# EAGLE design RFID v0.3 (EAGLE 9.5.2)
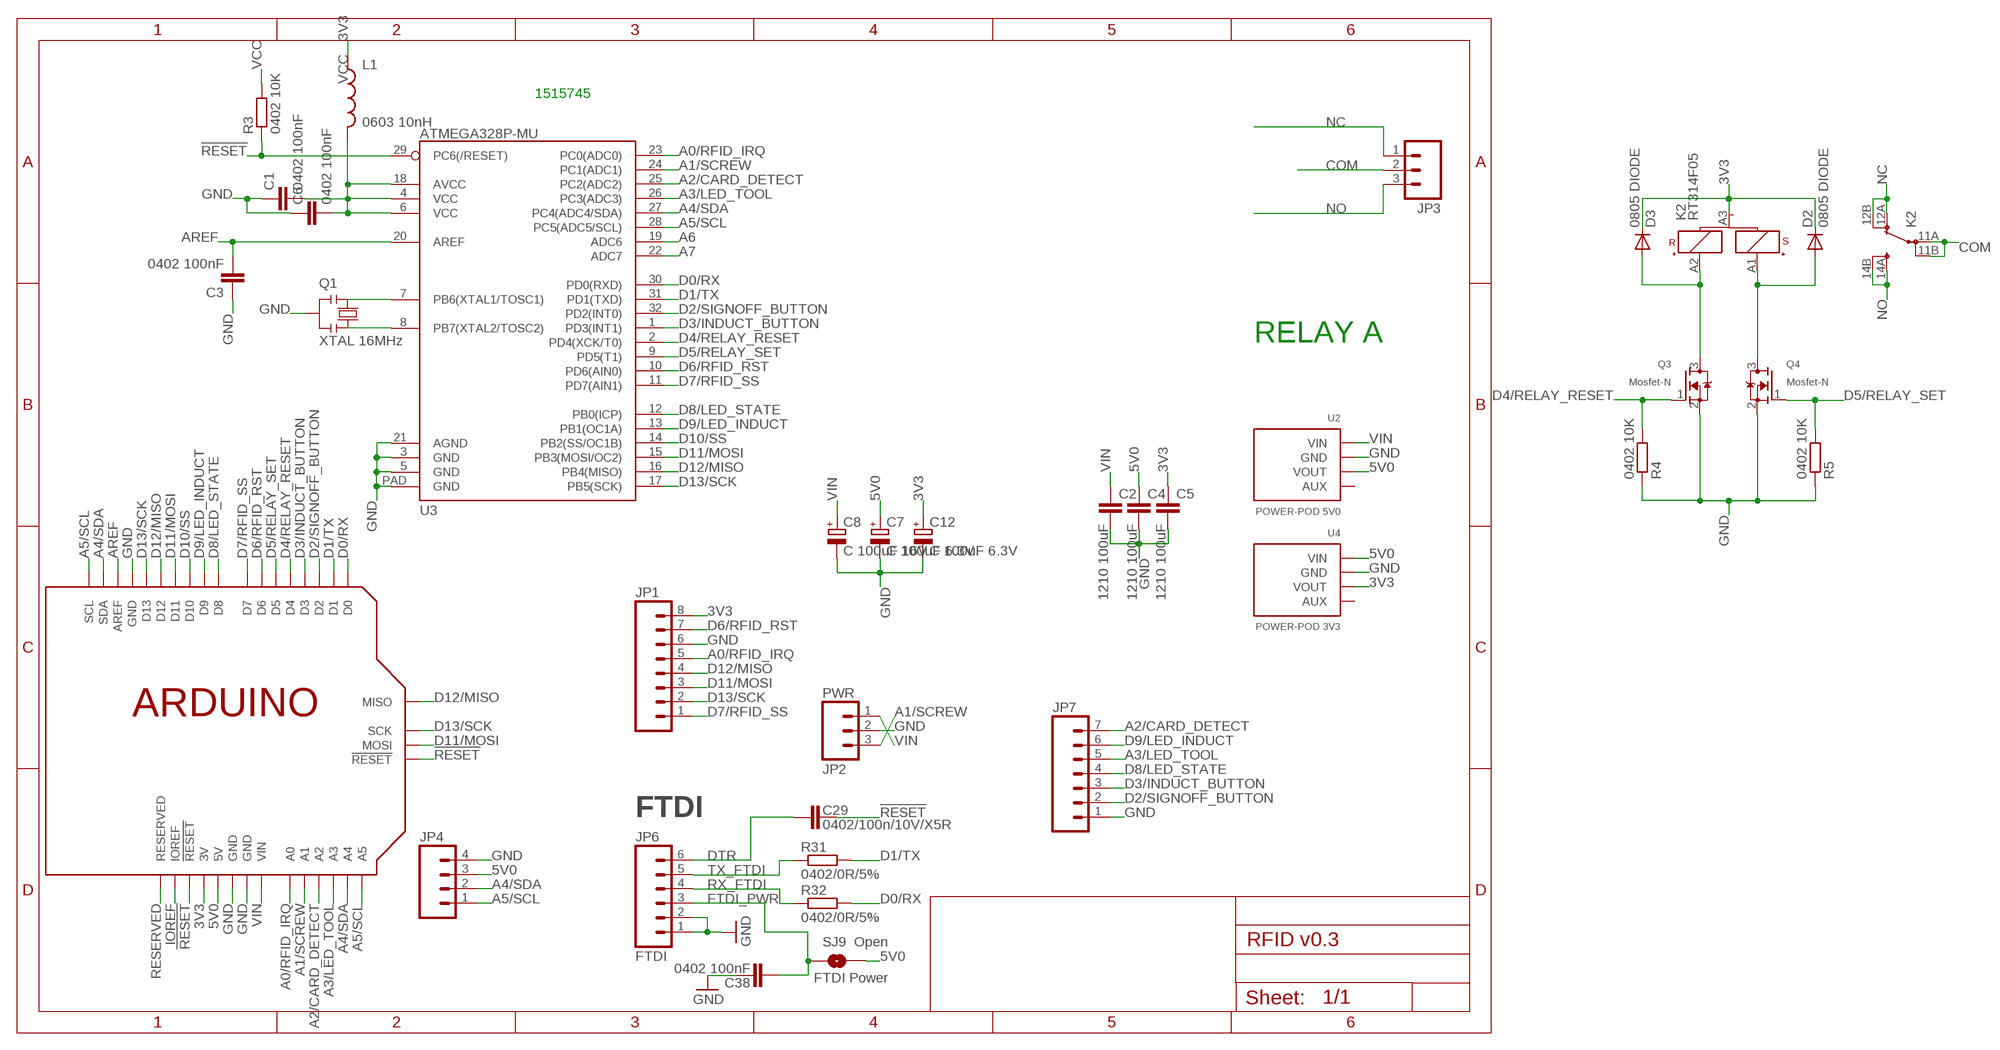
[diagram p0: schematic, sheet 1]

## Parts
C1  0402 100nF  C-EUC0402-SMALLER  [C0402-SMALLER]
C2  1210 100uF  C-EUC1210  [C1210]
C3  0402 100nF  C-EUC0402-SMALLER  [C0402-SMALLER]
C4  1210 100uF  C-EUC1210  [C1210]
C5  1210 100uF  C-EUC1210  [C1210]
C6  0402 100nF  C-EUC0402-SMALLER  [C0402-SMALLER]
C7  C 100uF 6.3V  CPOL-EUC  [PANASONIC_C]
C8  C 100uF 16V  CPOL-EUC  [PANASONIC_C]
C12  C 100uF 6.3V  CPOL-EUC  [PANASONIC_C]
C29  0402/100n/10V/X5R  C-EUC0402-ARDUINO-ROUND  [C0402-ARDUINO-ROUND]
C38  0402 100nF  C-EUC0402-SMALLER  [C0402-SMALLER]
D2  0805 DIODE  DIODE-0805  [0805-DIODE]
D3  0805 DIODE  DIODE-0805  [0805-DIODE]
JP1  M081X08  [1X08]
JP2  PWR  M03-SCREW-5MM  [SCREWTERMINAL-5MM-3]
JP3  M03-SCREW-5MM  [SCREWTERMINAL-5MM-3]
JP4  M04PTH  [1X04]
JP6  FTDI  M06SIP  [1X06]
JP7  M07  [1X07]
K2  RT314F05  [RT1-BI]
L1  0603 10nH  INDUCTOR0603K-SMALL  [C0603K-SMALL]
Q1  XTAL 16MHz  RESONATORMU  [RESONATOR]
Q3  Mosfet-N  MOSFET-N-SOT23-SPARK  [SOT23-3]
Q4  Mosfet-N  MOSFET-N-SOT23-SPARK  [SOT23-3]
R3  0402 10K  R-EU_R0402-SMALLER  [R0402-SMALLER]
R4  0402 10K  R-EU_R0402-SMALLER  [R0402-SMALLER]
R5  0402 10K  R-EU_R0402-SMALLER  [R0402-SMALLER]
R31  0402/0R/5%  R-EU_R0402-ARDUINO-ROUND  [R0402-ARDUINO-ROUND]
R32  0402/0R/5%  R-EU_R0402-ARDUINO-ROUND  [R0402-ARDUINO-ROUND]
SJ9  FTDI Power  SOLDERJUMPERNO  [SJ_2S-NO]
U1  ARDUINOSPI-REFRENCE  [ARDUINOR3-LWKTXT-REF-SPI]
U2  POWER-POD 5V0  POWER-POD  [POWER-POD-LANDING]
U3  ATMEGA328P-MU  ATMEGA328-MLF-SHORT  [MLF32-SHORT-CREAM]
U4  POWER-POD 3V3  POWER-POD  [POWER-POD-LANDING]

## Nets
3V3: C5.1 C12.+ D2.C D3.C JP1.8 K2.A3(1:-) L1.1 U1.3V U4.3(VOUT)
5V0: C4.1 C7.+ JP4.3 SJ9.2 U1.5V U1.5V@ISP(5V) U2.3(VOUT) U4.1(VIN)
!RESET: C29.1 R3.1 U1.!RESET U1.!RESET@ISP(!RESET) U3.29(PC6(/RESET))
A0/RFID_IRQ: JP1.5 U1.A0 U3.23(PC0(ADC0))
A1/SCREW: JP2.3 U1.A1 U3.24(PC1(ADC1))
A2/CARD_DETECT: JP7.7 U1.A2 U3.25(PC2(ADC2))
A3/LED_TOOL: JP7.5 U1.A3 U3.26(PC3(ADC3))
A4/SDA: JP4.2 U1.A4 U1.SDA U3.27(PC4(ADC4/SDA))
A5/SCL: JP4.1 U1.A5 U1.SCL U3.28(PC5(ADC5/SCL))
A6: U3.19(ADC6)
A7: U3.22(ADC7)
AREF: C3.2 U1.AREF U3.20(AREF)
COM [MAINS]: JP3.2 K2.11A(2:PA) K2.11B(2:PB)
D0/RX: R32.2 U1.D0 U3.30(PD0(RXD))
D1/TX: R31.2 U1.D1 U3.31(PD1(TXD))
D2/SIGNOFF_BUTTON: JP7.2 U1.D2 U3.32(PD2(INT0))
D3/INDUCT_BUTTON: JP7.3 U1.D3 U3.1(PD3(INT1))
D4/RELAY_RESET: Q3.1(G) R4.2 U1.D4 U3.2(PD4(XCK/T0))
D5/RELAY_SET: Q4.1(G) R5.2 U1.D5 U3.9(PD5(T1))
D6/RFID_RST: JP1.7 U1.D6 U3.10(PD6(AIN0))
D7/RFID_SS: JP1.1 U1.D7 U3.11(PD7(AIN1))
D8/LED_STATE: JP7.4 U1.D8 U3.12(PB0(ICP))
D9/LED_INDUCT: JP7.6 U1.D9 U3.13(PB1(OC1A))
D10/SS: U1.D10 U3.14(PB2(SS/OC1B))
D11/MOSI: JP1.3 U1.D11 U1.MOSI U3.15(PB3(MOSI/OC2))
D12/MISO: JP1.4 U1.D12 U1.MISO U3.16(PB4(MISO))
D13/SCK: JP1.2 U1.D13 U1.SCK U3.17(PB5(SCK))
DTR: C29.2 JP6.6
FTDI_PWR: C38.2 JP6.3 SJ9.1
GND: C1.1 C2.2 C3.1 C4.2 C5.2 C6.1 C7.- C8.- C12.- C38.1 JP1.6 JP2.2 JP4.4 JP6.1 JP6.2 JP7.1 Q1.2 Q3.2(S) Q4.2(S) R4.1 R5.1 U1.GND@1(GND) U1.GND@2(GND) U1.GND@3(GND) U1.GND@ISP(GND) U2.2(GND) U3.3(GND) U3.5(GND) U3.21(AGND) U3.PAD(GND) U4.2(GND)
IOREF: U1.IOREF
N$1: D2.A K2.A1(1:S+) Q4.3(D)
N$2: D3.A K2.A2(1:R+) Q3.3(D)
N$3: Q1.1 U3.7(PB6(XTAL1/TOSC1))
N$4: Q1.3 U3.8(PB7(XTAL2/TOSC2))
NC [MAINS]: JP3.1 K2.12A(2:OA) K2.12B(2:OB)
NO [MAINS]: JP3.3 K2.14A(2:SA) K2.14B(2:SB)
RESERVED: U1.RESERVED
RX_FTDI: JP6.4 R32.1
TX_FTDI: JP6.5 R31.1
VCC: C1.2 C6.2 L1.2 R3.2 U3.4(VCC) U3.6(VCC) U3.18(AVCC)
VIN: C2.1 C8.+ JP2.1 U1.VIN U2.1(VIN)
Unconnected: U2.4(AUX) U4.4(AUX)

## Notes on the sheet
- 1515745
- RELAY A
- FTDI
- Open

## Library data of the parts
C1-C6 = CISECO eaglecad designs:C-EU: CAPACITOR, European symbol
C7 C8 C12 = rcl:CPOL-EU: POLARIZED CAPACITOR, European symbol
C29 C38 = TiLDA Mk2 Parts:C-EU: CAPACITOR, European symbol
D2 D3 = CISECO eaglecad designs:DIODE-: DIODE
JP1 = SparkFunJan12:M08: Header 8 Standard 8-pin 0.1" header. Use with straight break away headers (SKU : PRT-00116), right angle break away headers (PRT-00553), swiss pins (PRT-00743), machine pins (PRT-00117), and female headers (PRT-00115).
JP2 JP3 = CISECO eaglecad designs:M03: Header 3 Standard 3-pin 0.1" header. Use with straight break away headers (SKU : PRT-00116), right angle break away headers (PRT-00553), swiss pins (PRT-00743), machine pins (PRT-00117), and female headers (PRT-00115). Molex polarized connector foot print use with SKU : PRT-08232 with associated crimp pins and housings.
JP4 = SparkFunJan12:M04: Header 4 Standard 4-pin 0.1" header. Use with straight break away headers (SKU : PRT-00116), right angle break away headers (PRT-00553), swiss pins (PRT-00743), machine pins (PRT-00117), and female headers (PRT-00115). Molex polarized connector foot print use with SKU : PRT-08231 with associated crimp pins and housings. 1MM SMD Version SKU: PRT-10208
JP6 = TiLDA Mk2 Parts:M06: Header 6 Standard 6-pin 0.1" header. Use with straight break away headers (SKU : PRT-00116), right angle break away headers (PRT-00553), swiss pins (PRT-00743), machine pins (PRT-00117), and female headers (PRT-00115). Molex polarized connector foot print use with SKU : PRT-08094 with associated crimp pins and housings. NOTES ON THE VARIANTS LOCK and LOCK_LONGPADS... This footprint was designed to help hold the alignment of a through-hole component (i.e. 6-pin header) while soldering it into place. You may notice that each hole has been shifted either up or down by 0.005 of an inch from it's more standard position (which is a perfectly straight line). This slight alteration caused the pins (the squares in the middle) to touch the edges of the holes. Because they are alternating, it causes a "brace" to hold the component in place. 0.005 has proven to be the perfect amount of "off-center" position when using our standard breakaway headers. Although looks a little odd when you look at the bare footprint, once you have a header in there, the alteration is very hard to notice. Also, if you push a header all the way into place, it is covered up entirely on the bottom side. This idea of altering the position of holes to aid alignment will be further integrated into the Sparkfun Library for other footprints. It can help hold any component with 3 or more connection pins.
JP7 = TiLDA Mk2 Parts:M07: Header 7 Standard 7-pin 0.1" header. Use with straight break away headers (SKU : PRT-00116), right angle break away headers (PRT-00553), swiss pins (PRT-00743), machine pins (PRT-00117), and female headers (PRT-00115). NOTES ON THE VARIANTS LOCK and LOCK_LONGPADS... This footprint was designed to help hold the alignment of a through-hole component (i.e. 7-pin header) while soldering it into place. You may notice that each hole has been shifted either up or down by 0.005 of an inch from it's more standard position (which is usually a perfectly straight line). This slight alteration caused the pins (the squares in the middle) to touch the edges of the holes. Because they are alternating, it causes a "brace" to hold the header in place. 0.005 has proven to be the perfect amount of "off-center" position when using our standard breakaway headers. Although looks a little odd when you look at the bare footprint, once you have a header in there, the alteration is very hard to notice. Also, if you push a header all the way into place, it is covered up entirely on the bottom side. This idea of altering the position of holes to aid alignment will be further integrated into the Sparkfun Library for other footprints. It can help hold any component with 3 or more connection pins.
K2 = relay:RT?F*: Power PCB Relay SCHRACK bistable 1 pole 16 A, polarized bistable version Source: http://www.schrack.com/.. 5821.pdf; MPN: RT314F05; OC_FARNELL: unknown; OC_NEWARK: 48M7949
L1 = CISECO eaglecad designs:INDUCTOR: Inductors Basic Inductor/Choke - 0603 and 1206. Footprints are not proven and vary greatly between part numbers.
Q1 = MySMD2:RESONATOR
Q3 Q4 = TiLDA Mk2 Parts:MOSFET-N: N-Channel Mosfet 2N7002E - 60V 260mA SOT23 [Digikey: 2N7002ET1GOSTR-ND] - REEL BSH103 - 30V 850mA SOT23 [Digikey: 568-5013-1-ND]
R3-R5 = CISECO eaglecad designs:R-EU_: RESISTOR, European symbol
R31 R32 = TiLDA Mk2 Parts:R-EU_: RESISTOR, European symbol
SJ9 = TiLDA Mk2 Parts:SOLDERJUMPER: Solder Jumper Standard SMD solder jumper. Used to automate production. Two varients : Normally Open and Normally Closed are the same, but have different paste layers. NC will have a large amount of paste and should jumper during reflow.
U1 = CISECO eaglecad designs:ARDUINOSPI
U2 U4 = Ciseco Footprints:POWER-POD
U3 = CISECO eaglecad designs:ATMEGA328-MLF

## Net classes
0 default: width 0.15 mm, drill 0.3 mm, clearance 0.15 mm
2 MAINS: clearance 4 mm

## Board
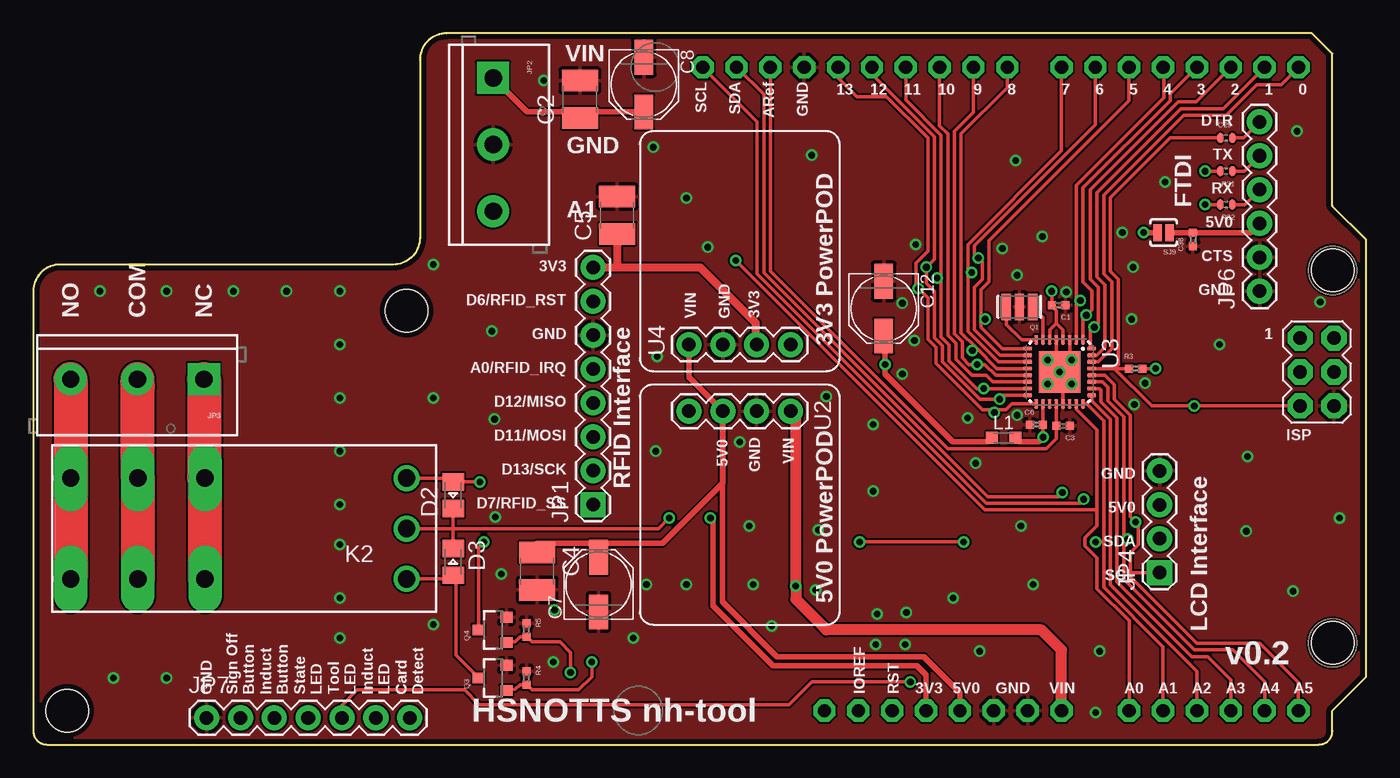
[diagram p1: board, top side]
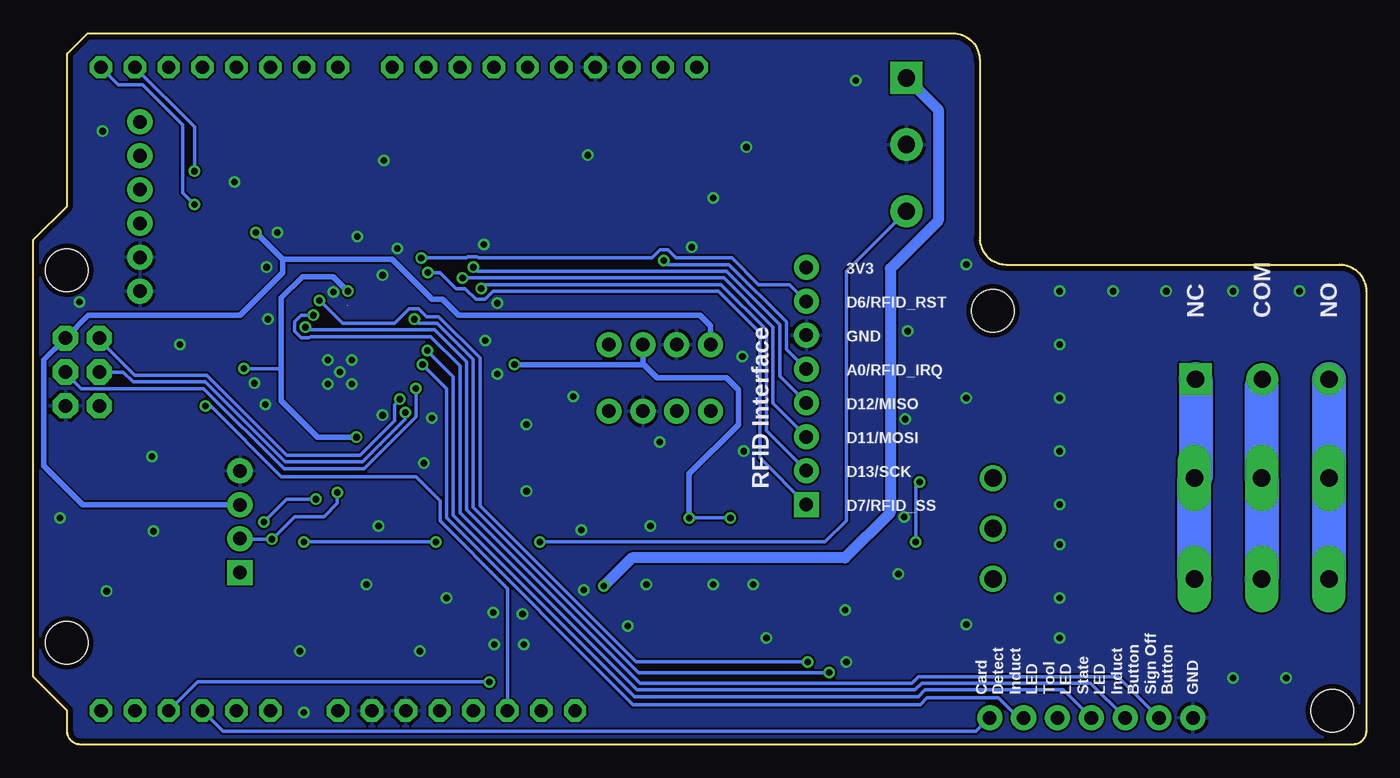
[diagram p2: board, bottom side, seen from below]

Size 100 x 53.34 mm. Coordinates in mm from the lower left corner, seen from the top.
Outline: 95.94,53.34 31,53.34 arc90 29,51.34 29,38 arc-90 27,36 2,36 arc90 0,34 0,1 arc90 1,0 96.46,0 arc90 97.46,1 97.46,2.54 100,5.08 100,37.85 97.46,40.39 97.46,51.82 95.94,53.34
Copper layers (1*16): Top 0.0356mm / dielectric 1.5011mm / Bottom 0.0356mm
Design rules "default *": minimum track width 6mil, minimum drill 13mil, track to track 6mil, track to pad 6mil, pad to pad 6mil, via to via 6mil, smd to smd 6mil, copper to edge 15mil, drill to drill 6mil, minimum pad ring 7mil, minimum via ring 7mil, stop-mask expansion 3mil, vias tented up to drill 23mil, thermal gap 10mil
Holes 3.2 mm at 2.54,2.54 97.48,35.56 97.48,7.62 28,32.54

### Footprints (pad centres in the part's own frame; a part is rotated, then mirrored left to right if it is on the bottom)
C0402-SMALLER = smd 0.6 x 0.6: 1 -0.5,0; 2 0.5,0
C1210 = smd 1.6 x 2.7: 1 -1.4,0; 2 1.4,0
PANASONIC_C = smd 2.6 x 1.4: + 2.05,0; - -2.05,0
C0402-ARDUINO-ROUND = smd 0.508 x 0.762: 1 -0.445,0; 2 0.445,0
0805-DIODE = smd 1.3 x 1.6: A 1,0; C -1,0
1X08 = drill 1.016 pad 1.88 square: 1 0,0 | drill 1.016 pad 1.88: 2 2.54,0; 3 5.08,0; 4 7.62,0; 5 10.16,0; 6 12.7,0; 7 15.24,0; 8 17.78,0
SCREWTERMINAL-5MM-3 = drill 1.3 pad 2.413 square: 1 0,0 | drill 1.3 pad 2.413: 2 5,0; 3 10,0
1X04 = drill 1.016 pad 1.88 square: 1 0,0 | drill 1.016 pad 1.88: 2 2.54,0; 3 5.08,0; 4 7.62,0
1X06 = drill 1.016 pad 1.88: 1 0,0; 2 2.54,0; 3 5.08,0; 4 7.62,0; 5 10.16,0; 6 12.7,0
1X07 = drill 1.016 pad 1.88: 1 0,0; 2 2.54,0; 3 5.08,0; 4 7.62,0; 5 10.16,0; 6 12.7,0; 7 15.24,0
RT1-BI = drill 1.3 pad 2.5 long: 11A 7.56,3.78; 11B 7.56,-3.78; 12A 2.52,3.78; 12B 2.52,-3.78; 14A 12.6,3.78; 14B 12.6,-3.78 | drill 1.3: A1 -12.6,-3.78; A2 -12.6,3.78; A3 -12.6,0
C0603K-SMALL = smd 0.889 x 0.889: 1 -0.875,0; 2 0.875,0
RESONATOR = smd 0.7 x 2: 1 -1,0; 2 0,0; 3 1,0
SOT23-3 = smd 0.8 x 0.9: 1 -0.95,-1; 2 0.95,-1; 3 0,1.1
R0402-SMALLER = smd 0.6 x 0.6: 1 -0.5,0; 2 0.5,0
R0402-ARDUINO-ROUND = smd 0.508 x 0.762: 1 -0.445,0; 2 0.445,0
SJ_2S-NO = smd 0.635 x 1.27: 1 -0.45,0; 2 0.45,0
ARDUINOR3-LWKTXT-REF-SPI = drill 1 pad 1.676 octagon: 3V 35.56,2.54; 5V 38.1,2.54; !RESET 33.02,2.54; A0 50.8,2.54; A1 53.34,2.54; A2 55.88,2.54; A3 58.42,2.54; A4 60.96,2.54; A5 63.5,2.54; AREF 23.876,50.8; D0 63.5,50.8; D1 60.96,50.8; D2 58.42,50.8; D3 55.88,50.8; D4 53.34,50.8; D5 50.8,50.8; D6 48.26,50.8; D7 45.72,50.8; D8 41.656,50.8; D9 39.116,50.8; D10 36.576,50.8; D11 34.036,50.8; D12 31.496,50.8; D13 28.956,50.8; GND@1 43.18,2.54; GND@2 40.64,2.54; GND@3 26.416,50.8; IOREF 30.48,2.54; RESERVED 27.94,2.54; SCL 18.796,50.8; SDA 21.336,50.8; VIN 45.72,2.54 | drill 1.016 pad 1.88 octagon: 5V@ISP 66.167,30.48; !RESET@ISP 63.627,25.4; GND@ISP 66.167,25.4; MISO 63.627,30.48; MOSI 66.167,27.94; SCK 63.627,27.94
POWER-POD-LANDING = drill 1.016 pad 1.88: 1 -3.81,0; 2 -1.27,0; 3 1.27,0; 4 3.81,0
MLF32-SHORT-CREAM = smd 0.7 x 0.28: 1 -2.4,1.75; 2 -2.4,1.25; 3 -2.4,0.75; 4 -2.4,0.25; 5 -2.4,-0.25; 6 -2.4,-0.75; 7 -2.4,-1.25; 8 -2.4,-1.75; 17 2.4,-1.75; 18 2.4,-1.25; 19 2.4,-0.75; 20 2.4,-0.25; 21 2.4,0.25; 22 2.4,0.75; 23 2.4,1.25; 24 2.4,1.75 | smd 0.28 x 0.7: 9 -1.75,-2.4; 10 -1.25,-2.4; 11 -0.75,-2.4; 12 -0.25,-2.4; 13 0.25,-2.4; 14 0.75,-2.4; 15 1.25,-2.4; 16 1.75,-2.4; 25 1.75,2.4; 26 1.25,2.4; 27 0.75,2.4; 28 0.25,2.4; 29 -0.25,2.4; 30 -0.75,2.4; 31 -1.25,2.4; 32 -1.75,2.4 | smd 3.1 x 3.1: PAD 0,0

### Placement (x,y rotation side)
C1  76.93,32.94 180 top
C2  41,48.4 90 top
C3  77.25,23.9 180 top
C4  37.8,13 270 top
C5  43.8,39.7 90 top
C6  75.25,24 0 top
C7  42.4,12 90 top
C8  45.8,49.5 270 top
C12  63.8,32.7 270 top
C29  89.5,45.5 0 top
C38  87,37.88 90 top
D2  31.5,18.7 90 top
D3  31.5,13.7 270 top
JP1  42,18 90 top
JP2  34.5,50 270 top
JP3  12.8,27.4 180 top
JP4  84.5,12.9 90 top
JP6  92,34 90 top
JP7  13,2 0 top
K2  15.4,16.2 180 top
L1  72.8,23 0 top
Q1  73.98,32.83 180 top
Q3  34.5,5 90 top
Q4  34.5,8.6 90 top
R3  82.7,28.2 0 top
R4  37,5 270 top
R5  37,8.6 270 top
R31  89.5,43 180 top
R32  89.5,40.5 180 top
SJ9  84.8,38.4 180 top
U1  31.42,0 0 top
U2  53,25 180 top
U3  77,27.95 270 top
U4  53,30 0 top

### Tracks (layer width: path | path; a pad name or v marks a point on that pad's centre or on a via)
3V3  (via drill 0.5)
  Top 0.254: K2.A3 31.52,16.2 | D2.C 31.5,16.22 31.52,16.2 | D3.C 31.5,16.18 31.52,16.2 | 31.52,16.2 46.9,16.2 v47.7,17
  Top 0.406: U1.3V 66.98,5.22 66.3,5.9 55.5,5.9 51,10.4 51,16.8 v50.8,17 | C12.+ 63.9,30.65 v63.9,28.5 63.9,27.8 69,22.7 71.62,22.7 L1.1
  Top 0.61: U4.3 54.2,30.07 54.2,31.6 50.02,35.78 JP1.8 43.8,35.78 C5.1
  Bottom 0.254: v47.7,17 v50.8,17
  Bottom 0.406: v50.8,17 50.8,20.3 47.1,24 47.1,26.6 48,27.5 53.2,27.5 54.3,28.6 | U4.3 54.27,28.63 54.3,28.6 | 54.3,28.6 54.4,28.5 v63.9,28.5
5V0  (via drill 0.5)
  Top 0.406: U1.5V 69.52,3.88 66.8,6.6 55.8,6.6 51.7,10.7 51.7,25 U2.3 | U4.1 49.19,27.54 U2.3 | 42.4,15.1 37.8,15.1 C4.1 | 42.4,15.1 47.2,15.1 51.73,19.63 U2.3 | v83.3,38.4 SJ9.2 | C7.+ 42.4,15.1
  Bottom 0.406: 81.3,36.4 73.1,36.4 70.1,33.4 69.3,33.4 68.1,32.2 50,32.2 49.2,31.4 U4.1 | 81.3,36.4 81.3,35.4 84.5,32.2 95.87,32.2 U1.5V@ISP 99.2,28.87 99.2,20.9 96.28,17.98 JP4.3 | 81.3,36.4 v83.3,38.4
!RESET  (via drill 0.5)
  Top 0.254: C29.1 85.3,45.5 80.8,41 80.8,35.5 81.4,34.9 81.4,28.5 81.1,28.2 | 81.1,28.2 R3.1 | 81.1,28.2 U3.29 | U1.!RESET@ISP v87.1,25.4 83.9,25.4 81.1,28.2
  Bottom 0.254: U1.!RESET 64.4,2.58 64.4,11.7 69.5,16.8 69.5,18.3 71.3,20.1 81.4,20.1 86.7,25.4 v87.1,25.4
A0/RFID_IRQ  (via drill 0.5)
  Top 0.254: 79.8,17.6 79.8,23.6 78.25,25.15 U3.23 | 79.8,17.6 79.8,16.4 78.9,15.5 78.9,14.9 79.8,14 79.8,11.7 82.22,9.28 U1.A0 | v52.7,36.3 71.4,17.6 79.8,17.6
  Bottom 0.254: JP1.5 43.5,29.66 43.5,31.7 47.8,36 52.4,36 v52.7,36.3
A1/SCREW  (via drill 0.5)
  Top 0.254: 80.3,15.2 80.3,24.3 79.05,25.55 U3.24 | 80.3,15.2 80.3,11.8 84.76,7.34 U1.A1 | v62,15.2 v69.8,15.2 | v79.7,15.2 80.3,15.2
  Bottom 0.254: v62,15.2 40.6,15.2 39,16.8 39,35.5 JP2.3 | v69.8,15.2 v79.7,15.2
A2/CARD_DETECT
  Top 0.254: U1.A2 87.3,5.5 80.8,12 80.8,24.4 79.4,25.8 U3.25
  Bottom 0.254: JP7.7 28.3,2 29.3,1 85.76,1 U1.A2
A3/LED_TOOL  (via drill 0.5)
  Top 0.254: U1.A3 89.84,4.86 88.1,6.6 86.9,6.6 81.3,12.2 81.3,24.5 80.1,25.7 80.1,26.6 80,26.7 U3.26 | JP7.5 23.16,2.96 24.3,4.1 32.35,4.1 33.45,3 56.7,3 58.4,4.7 v65.8,4.7
  Bottom 0.254: v65.8,4.7 87.68,4.7 U1.A3
A4/SDA  (via drill 0.5)
  Top 0.254: 81.8,15.4 81.8,24.6 80.6,25.8 80.6,26.8 80.2,27.2 U3.27 | 81.8,15.4 81.8,12.4 87.1,7.1 90,7.1 92.38,4.72 U1.A4 | v82.1,15.4 81.8,15.4 | U1.SDA 54.8,48.76 54.8,35.4 71.6,18.6 76.9,18.6 v77.2,18.9
  Bottom 0.254: JP4.2 84.5,15.4 v82.1,15.4 80.4,17.1 78.2,17.1 77.2,18.1 v77.2,18.9
A5/SCL  (via drill 0.5)
  Top 0.254: 82.3,12.9 82.3,12.6 87.3,7.6 92,7.6 94.92,4.68 U1.A5 | JP4.1 82.3,12.9 | 82.3,12.9 82.3,14.4 82.9,15 82.9,16.5 v82.7,16.7 82.3,17.1 82.3,24.7 81.1,25.9 81.1,27 80.4,27.7 U3.28 | U1.SCL 54.3,46.72 54.3,35.3 71.5,18.1 78.5,18.1 v78.8,18.4
  Bottom 0.254: v78.8,18.4 81,18.4 v82.7,16.7
AREF
  Top 0.254: U1.AREF 55.3,35.5 68.6,22.2 76,22.2 76.75,22.95 C3.2 U3.20
COM
  Top 2.54: JP3.2 7.84,26.86 K2.11B K2.11A
  Bottom 2.54: K2.11A K2.11B 7.84,26.86
D0/RX  (via drill 0.5)
  Top 0.254: U1.D0 93.62,49.5 91.8,49.5 89.5,47.2 86.3,47.2 80.3,41.2 80.3,35.3 80.9,34.7 80.9,29.7 79.9,28.7 U3.30 | R32.2 v87.9,40.5
  Bottom 0.254: v87.9,40.5 88.8,41.4 88.8,46.5 91.8,49.5 93.62,49.5 U1.D0
D1/TX  (via drill 0.5)
  Top 0.254: U1.D1 89.28,47.7 86.1,47.7 79.8,41.4 79.8,35.1 80.4,34.5 80.4,29.8 79.8,29.2 U3.31 | R31.2 v87.9,43
  Bottom 0.254: v87.9,43 87.9,46.32 U1.D1
D2/SIGNOFF_BUTTON  (via drill 0.5)
  Top 0.254: U1.D2 87.24,48.2 85.9,48.2 79.3,41.6 79.3,34.9 79.9,34.3 79.9,31.6 v79.6,31.3 79.3,31.3 79.3,29.8 U3.32
  Bottom 0.254: JP7.2 18.64,5.1 33.6,5.1 34.1,4.6 54.5,4.6 67.5,17.6 67.5,28.7 69.9,31.1 79.4,31.1 v79.6,31.3
D3/INDUCT_BUTTON  (via drill 0.5)
  Top 0.254: U3.1 78.75,32.2 v79,32.2 79.4,32.6 79.4,34.05 78.75,34.7 78.75,41.75 85.3,48.3 85.3,48.8 U1.D3
  Bottom 0.254: JP7.3 20.68,4.6 33.35,4.6 33.85,4.1 54.7,4.1 68,17.4 68,28.4 70.2,30.6 79.2,30.6 79.3,30.5 79.9,30.5 80.4,31 80.4,31.7 79.9,32.2 v79,32.2
D4/RELAY_RESET  (via drill 0.5)
  Top 0.254: U1.D4 84.8,50.76 84.8,48.5 78.25,41.95 78.25,33.3 | U3.2 78.25,33.3 | 78.25,33.3 v78.55,33.3 | v41.9,6.2 41.9,5.1 40.9,4.1 37.4,4.1 R4.2 36.5,4.5 36.15,4.15 35.58,4.12 Q3.1
  Bottom 0.254: v78.55,33.3 78.2,33 76.8,31.6 72.9,31.6 71.8,32.7 71.1,32.7 70.5,32.1 69.6,32.1 66.5,29 66.5,17.9 54.8,6.2 v41.9,6.2
D5/RELAY_SET  (via drill 0.5)
  Top 0.254: 71.1,31.9 71.1,31.3 72.7,29.7 U3.9 | 71.1,31.9 71.1,34.1 71.7,34.7 71.7,37.8 82.2,48.3 82.2,50.78 U1.D5 | v71.4,31.9 71.1,31.9 | v40.3,5.4 40.3,6.9 39.5,7.7 37.4,7.7 R5.2 36.52,8.1 36.15,7.72 35.58,7.72 Q4.1
  Bottom 0.254: v40.3,5.4 54.6,5.4 67,17.8 67,28.9 69.7,31.6 71.1,31.6 v71.4,31.9
D6/RFID_RST  (via drill 0.5)
  Top 0.254: U1.D6 79.68,46.48 70.6,37.4 70.6,36.8 v70.9,36.5 71.2,36.2 71.2,34.9 70.6,34.3 70.6,31.1 72.5,29.2 U3.10
  Bottom 0.254: JP1.7 43.26,34.5 45.6,34.5 47.6,36.5 51.8,36.5 52.4,37.1 53,37.1 53.6,36.5 66.6,36.5 66.7,36.6 67.4,36.6 67.5,36.5 v70.9,36.5
D7/RFID_SS  (via drill 0.5)
  Top 0.254: U3.11 72.4,28.7 70.1,31 70.1,35.4 | 70.1,35.4 70.1,37.5 77.14,44.54 U1.D7 | v70.4,35.4 70.1,35.4
  Bottom 0.254: JP1.1 45.5,21.5 45.5,30.9 48.6,34 65.5,34 66.1,33.4 66.8,33.4 67.6,34.2 68.3,34.2 69.5,35.4 v70.4,35.4
D8/LED_STATE  (via drill 0.5)
  Top 0.254: U3.12 72.3,28.2 70.7,29.8 | 70.7,29.8 69.6,30.9 69.6,45.8 73.08,49.28 U1.D8 | v70.45,29.55 70.7,29.8
  Bottom 0.254: JP7.4 22.72,4.1 33.1,4.1 33.6,3.6 54.9,3.6 68.5,17.2 68.5,27.6 v70.45,29.55
D9/LED_INDUCT  (via drill 0.5)
  Top 0.254: U3.13 72.2,27.7 71.4,28.5 v70.8,28.5 70.2,28.5 69.7,29 69.7,30.2 69.1,30.8 69.1,46 70.54,47.44 U1.D9
  Bottom 0.254: JP7.6 26.1,2 27.6,3.5 32.95,3.5 33.45,3 55,3 69,17 69,26.7 v70.8,28.5
D10/SS
  Top 0.254: U3.14 72,27.2 71.5,27.7 70.4,27.7 69.2,28.9 69.2,30.1 68.6,30.7 68.6,45.8 68,46.4 U1.D10
D11/MOSI  (via drill 0.5)
  Top 0.254: U3.15 v71.3,26.7 70.8,26.7 68.7,28.8 68.7,30 68.1,30.6 68.1,35 | 68.1,35 68.1,45.7 65.46,48.34 U1.D11 | v67.8,35 68.1,35
  Bottom 0.254: JP1.3 44.5,25.58 44.5,31.3 48.2,35 v67.8,35 | U1.MOSI 97.59,27.89 96.4,26.7 87.2,26.7 81.2,20.7 75.2,20.7 71.3,24.6 v71.3,26.7
D12/MISO  (via drill 0.5)
  Top 0.254: U3.16 72.8,26.2 v72.5,25.9 71,25.9 68.2,28.7 68.2,29.9 67.6,30.5 67.6,34 67,34.6 v67,35.8 67.6,36.4 67.6,45.6 62.92,50.28 U1.D12
  Bottom 0.254: JP1.4 44,27.62 44,31.5 48,35.5 66.7,35.5 v67,35.8 | U1.MISO 95.05,30.35 92.4,27.7 87,27.7 81,21.7 75.5,21.7 72.9,24.3 72.9,25.5 v72.5,25.9
D13/SCK  (via drill 0.5)
  Top 0.254: U1.D13 60.38,50.02 61.8,48.6 64,48.6 67.1,45.5 67.1,37 66.2,36.1 66.2,34.4 v66.4,34.2 67.1,33.5 67.1,30.4 67.7,29.8 67.7,28.6 71.2,25.1 72.1,25.1 | U3.17 73.4,25.55 72.95,25.1 72.1,25.1 | v72.1,24.9 72.1,25.1
  Bottom 0.254: JP1.2 45,23.54 45,31.1 48.4,34.5 66.1,34.5 v66.4,34.2 | U1.SCK 93.24,27.94 92.5,27.2 87.1,27.2 81.1,21.2 75.3,21.2 72.1,24.4 v72.1,24.9
DTR
  Top 0.254: JP6.6 90.8,45.5 C29.2
FTDI_PWR
  Top 0.406: JP6.3 91.31,38.39 C38.2 86.99,38.4 SJ9.1
GND  (via drill 0.5)
  Top 0.254: U3.5 76.75,28.2 U3.PAD | U3.PAD 77.75,28.7 U3.3 | U3.21 77.25,27.95 U3.PAD
  other vias: 77,27.95 76.1,27.05 77.9,27.05 77.9,28.85 76.1,28.85 77.5,33.95 73.8,24.7 82.6,25.5 83.4,27.1 73.8,35.2 82.4,31.9 82.5,35.8 65.2,27.8 65.2,33.1 66.2,37.5 50.6,37.3 46.8,29.1 53,22.7 46.7,22 53.7,16.4 58.9,16.1 55.4,8.9 63.3,9.8 58.7,11.6 65.5,9.9 63.2,7.5 65.4,7.5 79.7,2.4 74.1,16.4 70.7,21.1 70.1,24.5 59.5,26.1 58.4,44.2 73.7,43.8 75.7,38.1 84.9,42.2 94.8,46 96.55,33.2 91.1,21.6 94.5,11.5 39.1,10.1 39,6.2 35.1,12.8 34.65,17.06 38.3,49.8 46.5,44.8 34.6,24.4 34.4,31 72.7,37.2 81.7,38.4 66.1,30.3 5,34 10,34 15,34 19,34 23,34 23,30 23,26 23,22 23,18 23,15 23,11 6,5 10,5 23,8 30,36 30,26 49,41 89,30 98,17 91,16 80,7 75,12 69,11 71,7 63,19 63,24 54,12 49,12 46,12 45,8 30,9
  pour Bottom: 0,1 arc90 1,0 96.46,0 arc90 97.46,1 97.46,2.54 100,5.1 100,37.85 97.46,40.39 97.46,51.82 95.94,53.34 31,53.34 arc90 29,51.34 29,38 arc-90 27,36 2,36 arc90 0,34
  pour Top: 95.94,53.34 31,53.34 arc90 29,51.34 29,38 arc-90 27,36 2,36 arc90 0,34 0,1 arc90 1,0 96.46,0 arc90 97.46,1 97.46,2.54 100,5.1 100,37.85 97.46,40.39 97.46,51.82
N$1  (via drill 0.5)
  Top 0.254: K2.A1 31.72,19.98 D2.A v33.5,19.7 | Q4.3 33.4,14.8 v33.8,15.2
  Bottom 0.254: v33.8,15.2 33.8,19.4 v33.5,19.7
N$2
  Top 0.254: K2.A2 31.22,12.42 | 31.22,12.42 D3.A | 31.22,12.42 31.6,12.4 31.72,12.4 31.72,6.68 Q3.3
N$3
  Top 0.254: Q1.1 75.75,32.06 U3.7
N$4
  Top 0.254: Q1.3 73,32.81 73,31.5 74.15,30.35 U3.8
NC
  Top 2.54: K2.12A K2.12B 12.8,20.06 JP3.1
  Bottom 2.54: JP3.1 12.8,20.06 | K2.12A K2.12B
NO
  Top 2.54: JP3.3 K2.14B K2.14A
  Bottom 2.54: JP3.3 K2.14B K2.14A
RX_FTDI
  Top 0.254: JP6.4 90.88,40.5 R32.1
TX_FTDI
  Top 0.254: JP6.5 90.84,43 R31.1
VCC  (via drill 0.5)  (1 unrouted)
  Top 0.254: U3.18 C6.2 v75.75,23.05 | C1.2 76.47,32.9 76.5,32.9 | 76.75,31.6 77.25,31.1 U3.4 | 76.75,31.6 76.25,31.1 U3.6 | 76.75,31.6 76.75,32.52 76.4,32.87 | 76.4,32.87 76.43,32.9 | 76.4,32.87 v76.4,34 | R3.2 v84.2,28.2
  Top 0.406: v75.75,23.05 75.4,22.7 73.97,22.7 L1.2
  Bottom 0.254: v84.2,28.2 81.4,28.2
  Bottom 0.406: v76.4,34 77.5,35.1 79.8,35.1 81.4,33.5 81.4,28.2 81.4,25.8 78.65,23.05 v75.75,23.05
VIN  (via drill 0.5)
  Top 0.254: C2.1 41,47.35 41.1,47.45
  Top 0.406: C8.+ 41.1,47.45 37.04,47.45 37.03,47.47 JP2.1
  Top 0.813: U1.VIN 77.14,7.1 75.64,8.6 59.5,8.6 57.2,10.9 v57.2,11.9 57.2,24.61 U2.1
  Bottom 0.813: JP2.1 32.1,47.61 32.1,39.3 35.7,35.7 35.7,17.4 39.1,14 55.1,14 v57.2,11.9

### Text on the board
tPlace: VIN | DTR | TX | GND | RX | A1 | FTDI | 5V0 | CTS | 3V3 | D6/RFID_RST | GND | NO | COM | NC | 3V3 | GND | 1 | 3V3 PowerPOD | A0/RFID_IRQ | D12/MISO | D11/MOSI | 5V0 | ISP | D13/SCK | GND | RFID Interface | D7/RFID_SS | 5V0 | SDA | SCL | 5V0 PowerPOD | LCD Interface | v0.2 | GND | Sign Off / Button | Induct / Button | State / LED | Tool / LED | Induct / LED | Card / Detect | HSNOTTS nh-tool
bPlace: 3V3 | D6/RFID_RST | NO | COM | NC | GND | A0/RFID_IRQ | D12/MISO | D11/MOSI | D13/SCK | RFID Interface | D7/RFID_SS | GND | Sign Off / Button | Induct / Button | State / LED | Tool / LED | Induct / LED | Card / Detect